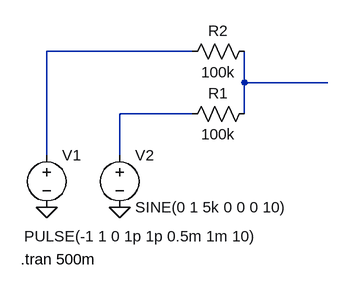
[diagram p0: schematic Summator, 100k, pulse 1V, 1kHz, sine 1V, 5kHz.asc]
Summator, 100k, pulse 1V, 1kHz, sine 1V, 5kHz.asc, the LTspice schematic file:
Version 4
SHEET 1 880 680
WIRE 96 -80 -128 -80
WIRE 176 -32 176 -80
WIRE 304 -32 176 -32
WIRE 96 16 -16 16
WIRE 176 16 176 -32
WIRE -128 80 -128 -80
WIRE -16 80 -16 16
FLAG -128 160 0
FLAG -16 160 0
SYMBOL res 192 0 R90
WINDOW 0 0 56 VBottom 2
WINDOW 3 32 56 VTop 2
SYMATTR InstName R1
SYMATTR Value 100k
SYMBOL res 192 -96 R90
WINDOW 0 0 56 VBottom 2
WINDOW 3 32 56 VTop 2
SYMATTR InstName R2
SYMATTR Value 100k
SYMBOL voltage -128 64 R0
WINDOW 123 0 0 Left 2
WINDOW 39 0 0 Left 2
WINDOW 3 -35 140 Left 2
SYMATTR InstName V1
SYMATTR Value PULSE(-1 1 0 1p 1p 0.5m 1m 10)
SYMBOL voltage -16 64 R0
WINDOW 123 0 0 Left 2
WINDOW 39 0 0 Left 2
SYMATTR InstName V2
SYMATTR Value SINE(0 1 5k 0 0 0 10)
TEXT -168 240 Left 2 !.tran 500m

The netlist it stands for:
* Summator, 100k, pulse 1V, 1kHz, sine 1V, 5kHz.asc
R1 N002 N003 100k
R2 N002 N001 100k
V1 N001 0 PULSE(-1 1 0 1p 1p 0.5m 1m 10)
V2 N003 0 SINE(0 1 5k 0 0 0 10)
.tran 500m
.backanno
.end